# Altium project controlo_rev2.PrjPcb
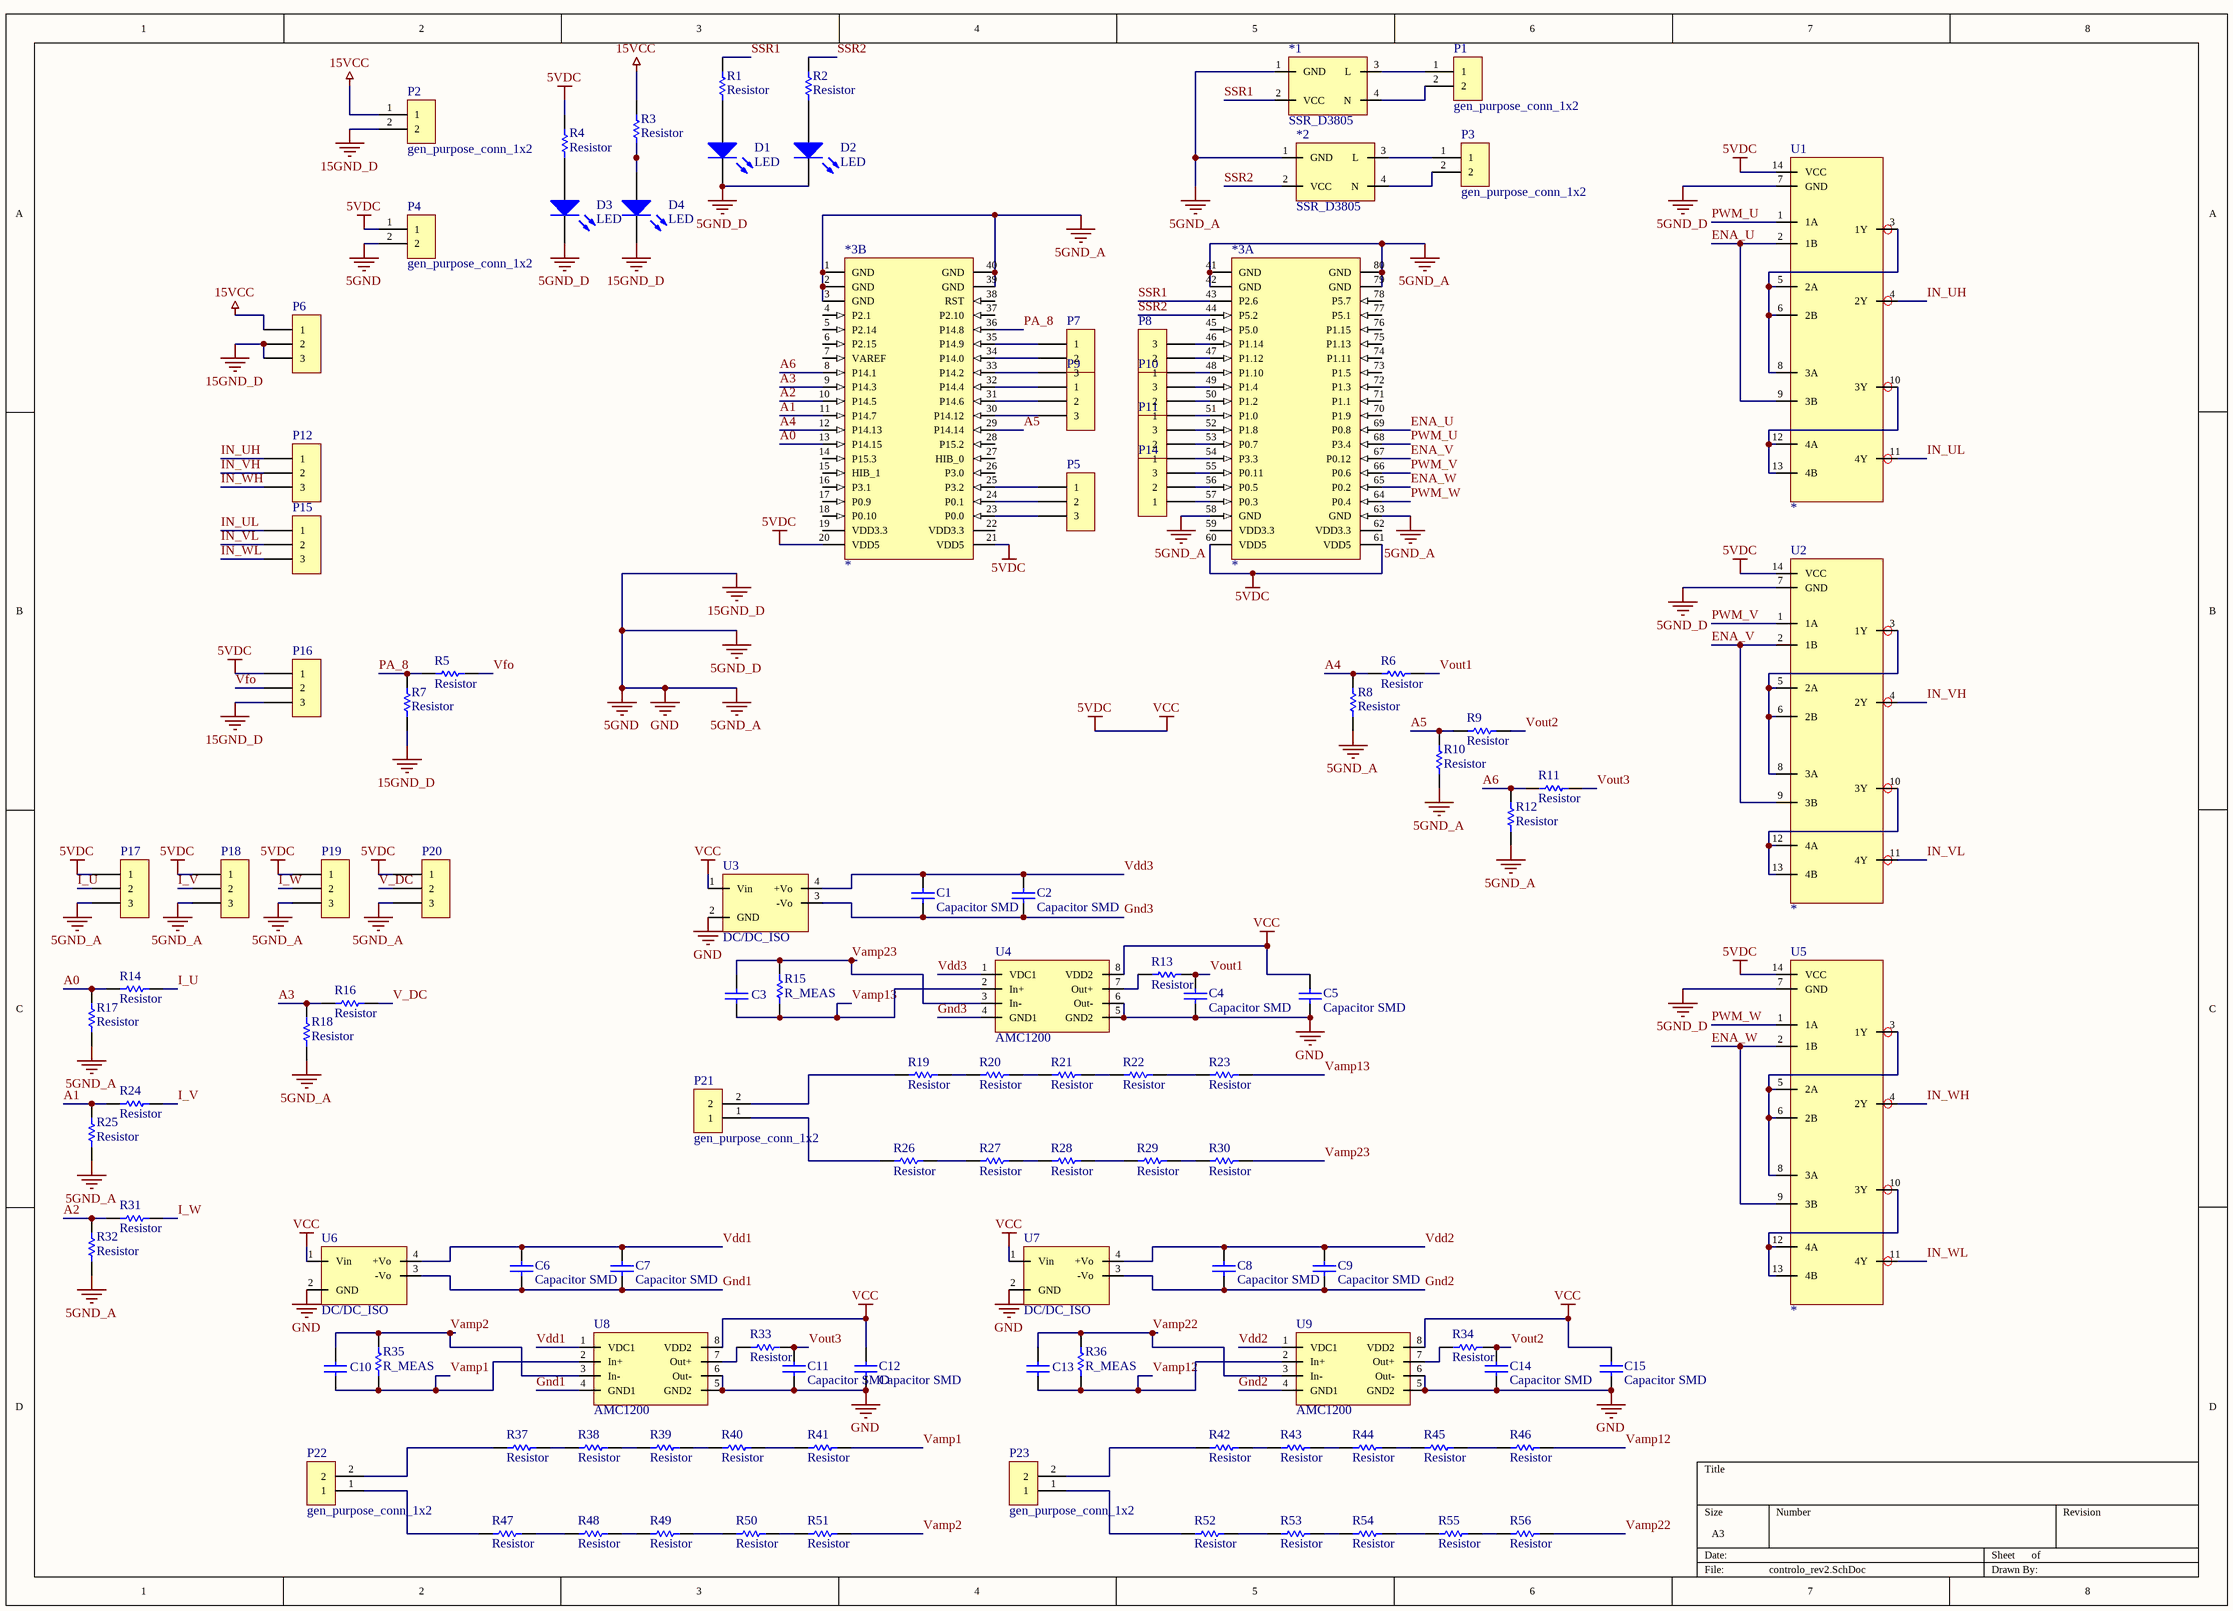
[diagram p0: controlo_rev2.SchDoc]
1 sheet, 109 parts. Net scope: global (net labels, ports and power ports of the same name join across sheets).
Board file: controlo_rev2.PcbDoc

## Sheet controlo_rev2.SchDoc
size A3

### Parts
*1  SSR_D3805  [SSR_D3805HK]
*2  SSR_D3805  [SSR_D3805HK]
*3  *  [XMC4500]  (parts A,B of 2)
C1  Capacitor SMD  [CAPC_0805]
C2  Capacitor SMD  [CAPC_0805]
C3  Capacitor SMD  [CAPC_0805]  (value not drawn)
C4  Capacitor SMD  [CAPC_0805]
C5  Capacitor SMD  [CAPC_0805]
C6  Capacitor SMD  [CAPC_0805]
C7  Capacitor SMD  [CAPC_0805]
C8  Capacitor SMD  [CAPC_0805]
C9  Capacitor SMD  [CAPC_0805]
C10  Capacitor SMD  [CAPC_0805]  (value not drawn)
C11  Capacitor SMD  [CAPC_0805]
C12  Capacitor SMD  [CAPC_0805]
C13  Capacitor SMD  [CAPC_0805]  (value not drawn)
C14  Capacitor SMD  [CAPC_0805]
C15  Capacitor SMD  [CAPC_0805]
D1  LED  [DIODE_1206]
D2  LED  [DIODE_1206]
D3  LED  [DIODE_1206]
D4  LED  [DIODE_1206]
P1  gen_purpose_conn_1x2  [connector1x2_parafuso]
P2  gen_purpose_conn_1x2  [connector1x2_parafuso]
P3  gen_purpose_conn_1x2  [connector1x2_parafuso]
P4  gen_purpose_conn_1x2  [connector1x2_parafuso]
P5  Header 3  [HDR1X3_simple]  (value not drawn)
P6  Header 3  (value not drawn)
P7  Header 3  [HDR1X3_simple]  (value not drawn)
P8  Header 3  [HDR1X3_simple]  (value not drawn)
P9  Header 3  [HDR1X3_simple]  (value not drawn)
P10  Header 3  [HDR1X3_simple]  (value not drawn)
P11  Header 3  [HDR1X3_simple]  (value not drawn)
P12  Header 3  (value not drawn)
P14  Header 3  [HDR1X3_simple]  (value not drawn)
P15  Header 3  (value not drawn)
P16  Header 3  (value not drawn)
P17  Header 3  (value not drawn)
P18  Header 3  (value not drawn)
P19  Header 3  (value not drawn)
P20  Header 3  (value not drawn)
P21  gen_purpose_conn_1x2  [connector1x2_parafuso]
P22  gen_purpose_conn_1x2  [connector1x2_parafuso]
P23  gen_purpose_conn_1x2  [connector1x2_parafuso]
R1  Resistor  [RESC_0805]
R2  Resistor  [RESC_0805]
R3  Resistor  [RESC_0805]
R4  Resistor  [RESC_0805]
R5  Resistor  [RESC_0805]
R6  Resistor  [RESC_0805]
R7  Resistor  [RESC_0805]
R8  Resistor  [RESC_0805]
R9  Resistor  [RESC_0805]
R10  Resistor  [RESC_0805]
R11  Resistor  [RESC_0805]
R12  Resistor  [RESC_0805]
R13  Resistor  [RESC_0805]
R14  Resistor  [RESC_0805]
R15  R_MEAS  [RESC_0805]
R16  Resistor  [RESC_0805]
R17  Resistor  [RESC_0805]
R18  Resistor  [RESC_0805]
R19  Resistor  [RESC_0805]
R20  Resistor  [RESC_0805]
R21  Resistor  [RESC_0805]
R22  Resistor  [RESC_0805]
R23  Resistor  [RESC_0805]
R24  Resistor  [RESC_0805]
R25  Resistor  [RESC_0805]
R26  Resistor  [RESC_0805]
R27  Resistor  [RESC_0805]
R28  Resistor  [RESC_0805]
R29  Resistor  [RESC_0805]
R30  Resistor  [RESC_0805]
R31  Resistor  [RESC_0805]
R32  Resistor  [RESC_0805]
R33  Resistor  [RESC_0805]
R34  Resistor  [RESC_0805]
R35  R_MEAS  [RESC_0805]
R36  R_MEAS  [RESC_0805]
R37  Resistor  [RESC_0805]
R38  Resistor  [RESC_0805]
R39  Resistor  [RESC_0805]
R40  Resistor  [RESC_0805]
R41  Resistor  [RESC_0805]
R42  Resistor  [RESC_0805]
R43  Resistor  [RESC_0805]
R44  Resistor  [RESC_0805]
R45  Resistor  [RESC_0805]
R46  Resistor  [RESC_0805]
R47  Resistor  [RESC_0805]
R48  Resistor  [RESC_0805]
R49  Resistor  [RESC_0805]
R50  Resistor  [RESC_0805]
R51  Resistor  [RESC_0805]
R52  Resistor  [RESC_0805]
R53  Resistor  [RESC_0805]
R54  Resistor  [RESC_0805]
R55  Resistor  [RESC_0805]
R56  Resistor  [RESC_0805]
U1  *  [SOIC-14N]
U2  *  [SOIC-14N]
U3  DC/DC_ISO  [DC/DC_ISO]
U4  AMC1200  [SOIC8]
U5  *  [SOIC-14N]
U6  DC/DC_ISO  [DC/DC_ISO]
U7  DC/DC_ISO  [DC/DC_ISO]
U8  AMC1200  [SOIC8]
U9  AMC1200  [SOIC8]

### Nets
5VDC: *3.20(VDD5) *3.21(VDD5) *3.60(VDD5) *3.61(VDD5) C5.2 C12.2 C15.2 P4.1 P16.1 P17.1 P18.1 P19.1 P20.1 R4.2 U1.14(VCC) U2.14(VCC) U3.1(Vin) U4.8(VDD2) U5.14(VCC) U6.1(Vin) U7.1(Vin) U8.8(VDD2) U9.8(VDD2)  [also labelled VCC]
15GND_D: *1.1(GND) *2.1(GND) *3.1(GND) *3.2(GND) *3.3(GND) *3.39(GND) *3.40(GND) *3.41(GND) *3.42(GND) *3.58(GND) *3.63(GND) *3.79(GND) *3.80(GND) C4.1 C5.1 C11.1 C12.1 C14.1 C15.1 D1.2(K) D2.2(K) D3.2(K) D4.2(K) P2.2 P4.2 P6.2 P6.3 P16.3 P17.3 P18.3 P19.3 P20.3 R7.1 R8.1 R10.1 R12.1 R17.1 R18.1 R25.1 R32.1 U1.7(GND) U2.7(GND) U3.2(GND) U4.5(GND2) U4.6(Out-) U5.7(GND) U6.2(GND) U7.2(GND) U8.5(GND2) U8.6(Out-) U9.5(GND2) U9.6(Out-)  [also labelled 5GND, 5GND_A, 5GND_D, GND]
15VCC: P2.1 P6.1 R3.2
A0: *3.13(P14.15) R14.1 R17.2
A1: *3.11(P14.7) R24.1 R25.2
A2: *3.10(P14.5) R31.1 R32.2
A3: *3.9(P14.3) R16.1 R18.2
A4: *3.12(P14.13) R6.1 R8.2
A5: *3.29(P14.14) R9.1 R10.2
A6: *3.8(P14.1) R11.1 R12.2
ENA_U: *3.69(P0.8) U1.2(1B) U1.9(3B)
ENA_V: *3.67(P0.12) U2.2(1B) U2.9(3B)
ENA_W: *3.65(P0.2) U5.2(1B) U5.9(3B)
Gnd1: C6.1 C7.1 U6.3(-Vo) U8.4(GND1)
Gnd2: C8.1 C9.1 U7.3(-Vo) U9.4(GND1)
Gnd3: C1.1 C2.1 U3.3(-Vo) U4.4(GND1)
I_U: P17.2 R14.2
I_V: P18.2 R24.2
I_W: P19.2 R31.2
IN_UH: P12.1 U1.4(2Y)
IN_UL: P15.1 U1.11(4Y)
IN_VH: P12.2 U2.4(2Y)
IN_VL: P15.2 U2.11(4Y)
IN_WH: P12.3 U5.4(2Y)
IN_WL: P15.3 U5.11(4Y)
PA_8: *3.36(P14.8) R5.1 R7.2
PWM_U: *3.68(P3.4) U1.1(1A)
PWM_V: *3.66(P0.6) U2.1(1A)
PWM_W: *3.64(P0.4) U5.1(1A)
SSR1: *1.2(VCC) *3.43(P2.6) R1.2
SSR2: *2.2(VCC) *3.44(P5.2) R2.2
V_DC: P20.2 R16.2
Vamp1: C10.1 R35.1 R41.2 U8.2(In+)
Vamp2: C10.2 R35.2 R51.2 U8.3(In-)
Vamp12: C13.1 R36.1 R46.2 U9.2(In+)
Vamp13: C3.1 R15.1 R23.2 U4.2(In+)
Vamp22: C13.2 R36.2 R56.2 U9.3(In-)
Vamp23: C3.2 R15.2 R30.2 U4.3(In-)
Vdd1: C6.2 C7.2 U6.4(+Vo) U8.1(VDC1)
Vdd2: C8.2 C9.2 U7.4(+Vo) U9.1(VDC1)
Vdd3: C1.2 C2.2 U3.4(+Vo) U4.1(VDC1)
Vfo: P16.2 R5.2
Vout1: C4.2 R6.2 R13.2
Vout2: C14.2 R9.2 R34.2
Vout3: C11.2 R11.2 R33.2
Net*1_3: *1.3(L) P1.1
Net*1_4: *1.4(N) P1.2
Net*2_3: *2.3(L) P3.1
Net*2_4: *2.4(N) P3.2
Net*3_23: *3.23(P0.0) P5.3
Net*3_24: *3.24(P0.1) P5.2
Net*3_25: *3.25(P3.2) P5.1
Net*3_30: *3.30(P14.12) P9.3
Net*3_31: *3.31(P14.6) P9.2
Net*3_32: *3.32(P14.4) P9.1
Net*3_33: *3.33(P14.2) P7.3
Net*3_34: *3.34(P14.0) P7.2
Net*3_35: *3.35(P14.9) P7.1
Net*3_46: *3.46(P1.14) P8.3
Net*3_47: *3.47(P1.12) P8.2
Net*3_48: *3.48(P1.10) P8.1
Net*3_49: *3.49(P1.4) P10.3
Net*3_50: *3.50(P1.2) P10.2
Net*3_51: *3.51(P1.0) P10.1
Net*3_52: *3.52(P1.8) P11.3
Net*3_53: *3.53(P0.7) P11.2
Net*3_54: *3.54(P3.3) P11.1
Net*3_55: *3.55(P0.11) P14.3
Net*3_56: *3.56(P0.5) P14.2
Net*3_57: *3.57(P0.3) P14.1
NetD1_1: D1.1(A) R1.1
NetD2_1: D2.1(A) R2.1
NetD3_1: D3.1(A) R4.1
NetD4_1: D4.1(A) R3.1
NetP21_1: P21.1 R26.1
NetP21_2: P21.2 R19.1
NetP22_1: P22.1 R47.1
NetP22_2: P22.2 R37.1
NetP23_1: P23.1 R52.1
NetP23_2: P23.2 R42.1
NetR13_1: R13.1 U4.7(Out+)
NetR19_2: R19.2 R20.1
NetR20_2: R20.2 R21.1
NetR21_2: R21.2 R22.1
NetR22_2: R22.2 R23.1
NetR26_2: R26.2 R27.1
NetR27_2: R27.2 R28.1
NetR28_2: R28.2 R29.1
NetR29_2: R29.2 R30.1
NetR33_1: R33.1 U8.7(Out+)
NetR34_1: R34.1 U9.7(Out+)
NetR37_2: R37.2 R38.1
NetR38_2: R38.2 R39.1
NetR39_2: R39.2 R40.1
NetR40_2: R40.2 R41.1
NetR42_2: R42.2 R43.1
NetR43_2: R43.2 R44.1
NetR44_2: R44.2 R45.1
NetR45_2: R45.2 R46.1
NetR47_2: R47.2 R48.1
NetR48_2: R48.2 R49.1
NetR49_2: R49.2 R50.1
NetR50_2: R50.2 R51.1
NetR52_2: R52.2 R53.1
NetR53_2: R53.2 R54.1
NetR54_2: R54.2 R55.1
NetR55_2: R55.2 R56.1
NetU1_3: U1.3(1Y) U1.5(2A) U1.6(2B) U1.8(3A)
NetU1_10: U1.10(3Y) U1.12(4A) U1.13(4B)
NetU2_3: U2.3(1Y) U2.5(2A) U2.6(2B) U2.8(3A)
NetU2_10: U2.10(3Y) U2.12(4A) U2.13(4B)
NetU5_3: U5.3(1Y) U5.5(2A) U5.6(2B) U5.8(3A)
NetU5_10: U5.10(3Y) U5.12(4A) U5.13(4B)

Not connected (* = marked no-connect by the designer): *3 4(P2.1) 5(P2.14) 6(P2.15) 7(VAREF) 14(P15.3) 15(HIB_1) 16(P3.1) 17(P0.9) 18(P0.10) 19(VDD3.3) 22(VDD3.3) 26(P3.0) 27(HIB_0) 28(P15.2) 37(P2.10) 38(RST) 45(P5.0) 59(VDD3.3) 62(VDD3.3) 70(P1.9) 71(P1.1) 72(P1.3) 73(P1.5) 74(P1.11) 75(P1.13) 76(P1.15) 77(P5.1) 78(P5.7)

### Library data of the parts
*3 = XMC4500
C1 C2 C5-C9 C12 C15 = Capacitor SMD: 10uF; LCSC: C337995
C3 C4 C10 C11 C13 C14 = Capacitor SMD: 1uF; LCSC: C282734
P5-P12 P14-P20 = Header 3: Header, 3 pin
R5 R6 R9 R11 R14 R16 R24 R31 = Resistor: 5K; LCSC: C105427
R7 R8 R10 R12 R17 R18 R25 R32 = Resistor: 7K5; LCSC: C294739
R13 R33 R34 = Resistor: 330R; LCSC: C269732
R15 R35 R36 = Resistor: 150R
R19-R23 R26-R30 R37-R56 = Resistor: 30K
U1 U2 U5 = HEF4011
U3 U6 U7 = DC/DC_ISO: LCSC: C98815
U4 U8 U9 = AMC1200: LCSC: C79905